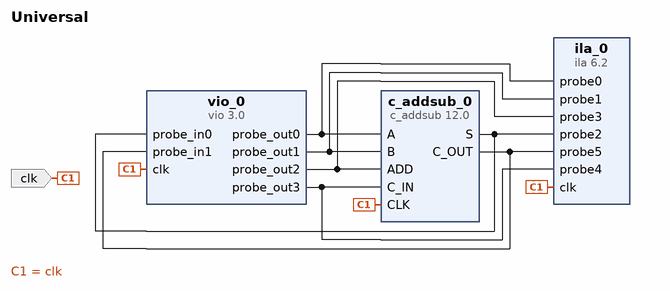
[diagram p0: block diagram of the top level]
# Vivado block design Universal, xc7z020clg484-1, Vivado 2018.2
create_bd_design Universal

create_bd_port -dir I -type clk clk

create_bd_cell -type ip -vlnv xilinx.com:ip:c_addsub:12.0 c_addsub_0
set_property -dict [list \
  CONFIG.Implementation Fabric \
  CONFIG.A_Type Unsigned \
  CONFIG.B_Type Unsigned \
  CONFIG.A_Width 64 \
  CONFIG.B_Width 64 \
  CONFIG.Add_Mode Add_Subtract \
  CONFIG.Out_Width 64 \
  CONFIG.Latency 1 \
  CONFIG.B_Value 0000000000000000000000000000000000000000000000000000000000000000 \
  CONFIG.CE false \
  CONFIG.C_In true \
  CONFIG.C_Out true \
] [get_bd_cells c_addsub_0]
create_bd_cell -type ip -vlnv xilinx.com:ip:vio:3.0 vio_0
set_property -dict [list \
  CONFIG.C_PROBE_OUT1_WIDTH 64 \
  CONFIG.C_PROBE_OUT0_WIDTH 64 \
  CONFIG.C_NUM_PROBE_OUT 4 \
  CONFIG.C_NUM_PROBE_IN 2 \
] [get_bd_cells vio_0]
create_bd_cell -type ip -vlnv xilinx.com:ip:ila:6.2 ila_0
set_property -dict [list \
  CONFIG.C_PROBE2_WIDTH 64 \
  CONFIG.C_PROBE1_WIDTH 64 \
  CONFIG.C_PROBE0_WIDTH 64 \
  CONFIG.C_NUM_OF_PROBES 6 \
  CONFIG.C_ENABLE_ILA_AXI_MON false \
  CONFIG.C_MONITOR_TYPE Native \
] [get_bd_cells ila_0]

# ---- connections ----

connect_bd_net [get_bd_pins vio_0/probe_out0] [get_bd_pins c_addsub_0/A] [get_bd_pins ila_0/probe0]
connect_bd_net [get_bd_pins vio_0/probe_out1] [get_bd_pins c_addsub_0/B] [get_bd_pins ila_0/probe1]
connect_bd_net [get_bd_pins vio_0/probe_out2] [get_bd_pins c_addsub_0/ADD] [get_bd_pins ila_0/probe3]
connect_bd_net [get_bd_pins vio_0/probe_out3] [get_bd_pins c_addsub_0/C_IN] [get_bd_pins ila_0/probe4]
connect_bd_net [get_bd_pins c_addsub_0/S] [get_bd_pins vio_0/probe_in0] [get_bd_pins ila_0/probe2]
connect_bd_net [get_bd_pins c_addsub_0/C_OUT] [get_bd_pins vio_0/probe_in1] [get_bd_pins ila_0/probe5]
connect_bd_net -net clk_0_1 [get_bd_ports clk] [get_bd_pins vio_0/clk] [get_bd_pins c_addsub_0/CLK] [get_bd_pins ila_0/clk]

validate_bd_design
save_bd_design
